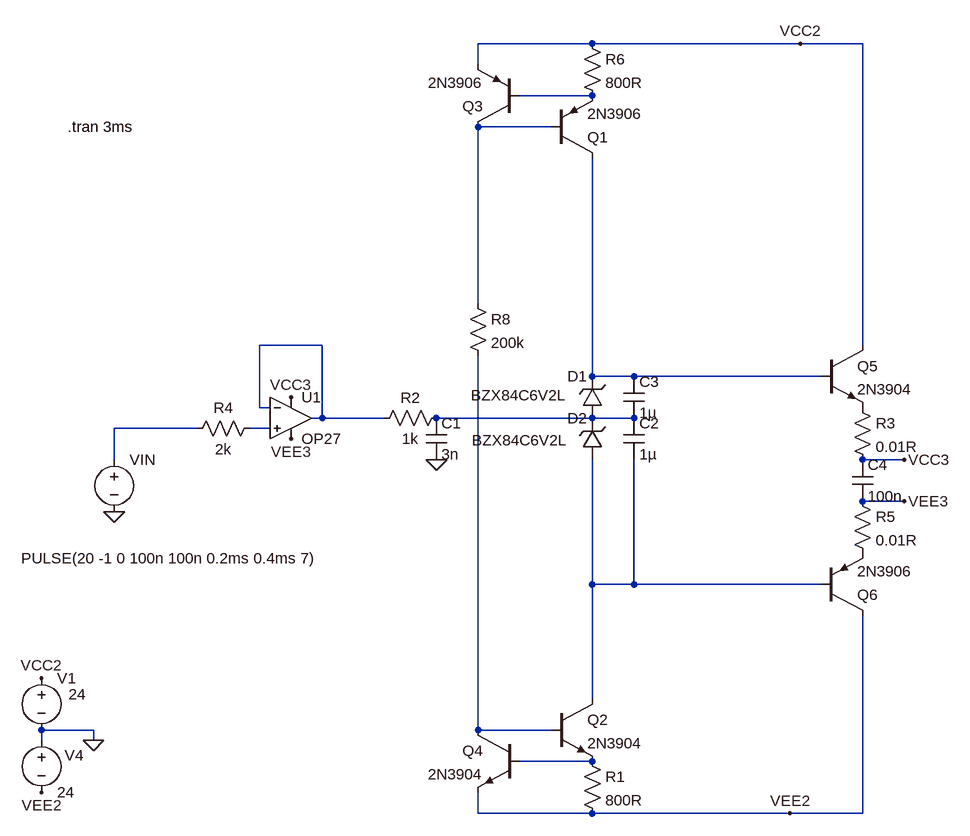
[diagram p0: schematic Draft01.asc]
Draft01.asc, the LTspice schematic file:
Version 4
SHEET 1 2336 896
WIRE 704 -416 528 -416
WIRE 1024 -416 704 -416
WIRE 1120 -416 1024 -416
WIRE 528 -384 528 -416
WIRE 704 -336 592 -336
WIRE 640 -288 528 -288
WIRE 528 -16 528 -288
WIRE 288 48 192 48
WIRE 1120 48 1120 -416
WIRE 704 96 704 -240
WIRE 768 96 704 96
WIRE 1056 96 768 96
WIRE 192 144 192 48
WIRE 208 144 192 144
WIRE 288 160 288 48
WIRE 288 160 272 160
WIRE 384 160 288 160
WIRE 704 160 464 160
WIRE 768 160 704 160
WIRE 96 176 -32 176
WIRE 208 176 176 176
WIRE -32 224 -32 176
WIRE 1184 224 1120 224
WIRE 1184 288 1120 288
WIRE 704 416 704 224
WIRE 768 416 768 224
WIRE 768 416 704 416
WIRE 1056 416 768 416
WIRE 704 592 704 416
WIRE -64 640 -144 640
WIRE 528 640 528 64
WIRE 640 640 528 640
WIRE -144 656 -144 640
WIRE -64 656 -64 640
WIRE 704 688 592 688
WIRE 528 768 528 736
WIRE 704 768 528 768
WIRE 1008 768 704 768
WIRE 1120 768 1120 464
WIRE 1120 768 1008 768
FLAG -32 304 0
FLAG -64 656 0
FLAG -144 560 VCC2
FLAG -144 736 VEE2
FLAG 1024 -416 VCC2
FLAG 1008 768 VEE2
FLAG 1184 224 VCC3
FLAG 1184 288 VEE3
FLAG 240 128 VCC3
FLAG 240 192 VEE3
FLAG 464 224 0
SYMBOL voltage -32 208 R0
WINDOW 123 0 0 Left 0
WINDOW 39 0 0 Left 0
WINDOW 3 -143 168 Left 2
SYMATTR Value PULSE(20 -1 0 100n 100n 0.2ms 0.4ms 7)
SYMATTR InstName VIN
SYMBOL res 192 160 R90
WINDOW 0 0 56 VBottom 2
WINDOW 3 32 56 VTop 2
SYMATTR InstName R4
SYMATTR Value 2k
SYMBOL pnp 640 -240 M180
SYMATTR InstName Q1
SYMATTR Value 2N3906
SYMBOL pnp 592 -288 R180
SYMATTR InstName Q3
SYMATTR Value 2N3906
SYMBOL res 688 -432 R0
SYMATTR InstName R6
SYMATTR Value 800R
SYMBOL voltage -144 544 R0
WINDOW 123 0 0 Left 0
WINDOW 39 0 0 Left 0
WINDOW 3 42 41 Left 2
SYMATTR Value 24
SYMATTR InstName V1
SYMBOL voltage -144 640 R0
WINDOW 123 0 0 Left 0
WINDOW 39 0 0 Left 0
WINDOW 0 36 39 Left 2
SYMATTR InstName V4
SYMATTR Value 24
SYMBOL res 512 -32 R0
SYMATTR InstName R8
SYMATTR Value 200k
SYMBOL zener 720 160 R180
WINDOW 0 24 64 Left 2
WINDOW 3 56 35 Left 2
SYMATTR InstName D1
SYMATTR Value BZX84C6V2L
SYMBOL zener 720 224 R180
WINDOW 0 24 64 Left 2
WINDOW 3 54 30 Left 2
SYMATTR InstName D2
SYMATTR Value BZX84C6V2L
SYMBOL npn 640 592 R0
SYMATTR InstName Q2
SYMATTR Value 2N3904
SYMBOL res 688 672 R0
SYMATTR InstName R1
SYMATTR Value 800R
SYMBOL npn 592 640 M0
SYMATTR InstName Q4
SYMATTR Value 2N3904
SYMBOL res 480 144 R90
WINDOW 0 0 56 VBottom 2
WINDOW 3 32 56 VTop 2
SYMATTR InstName R2
SYMATTR Value 1k
SYMBOL cap 448 160 R0
SYMATTR InstName C1
SYMATTR Value 3n
SYMBOL OpAmps\\OP27 240 96 R0
SYMATTR InstName U1
SYMBOL npn 1056 48 R0
SYMATTR InstName Q5
SYMATTR Value 2N3904
SYMBOL pnp 1056 464 M180
SYMATTR InstName Q6
SYMATTR Value 2N3906
SYMBOL res 1104 128 R0
SYMATTR InstName R3
SYMATTR Value 0.01R
SYMBOL res 1104 272 R0
SYMATTR InstName R5
SYMATTR Value 0.01R
SYMBOL cap 752 96 R0
SYMATTR InstName C3
SYMATTR Value 1µ
SYMBOL cap 752 160 R0
SYMATTR InstName C2
SYMATTR Value 1µ
SYMBOL cap 1104 224 R0
SYMATTR InstName C4
SYMATTR Value 100n
TEXT -104 -288 Left 2 !.tran 3ms

The netlist it stands for:
* Draft01.asc
VIN N006 0 PULSE(20 -1 0 100n 100n 0.2ms 0.4ms 7)
R4 N007 N006 2k
Q1 N004 N002 N001 0 2N3906
Q3 N002 N001 VCC2 0 2N3906
R6 VCC2 N001 800R
V1 VCC2 0 24
V4 0 VEE2 24
R8 N002 N009 200k
D1 N005 N004 BZX84C6V2L
D2 N008 N005 BZX84C6V2L
Q2 N008 N009 N010 0 2N3904
R1 N010 VEE2 800R
Q4 N009 N010 VEE2 0 2N3904
R2 N005 N003 1k
C1 N005 0 3n
XU1 N007 N003 VCC3 VEE3 N003 OP27  ; pins In+ In- V+ V- OUT
Q5 VCC2 N004 P001 0 2N3904
Q6 VEE2 N008 P002 0 2N3906
R3 P001 VCC3 0.01R
R5 VEE3 P002 0.01R
C3 N004 N005 1µ
C2 N005 N008 1µ
C4 VCC3 VEE3 100n
.model D D
.lib standard.dio
.model NPN NPN
.model PNP PNP
.lib standard.bjt
.tran 3ms
.lib ADI.lib
.backanno
.end